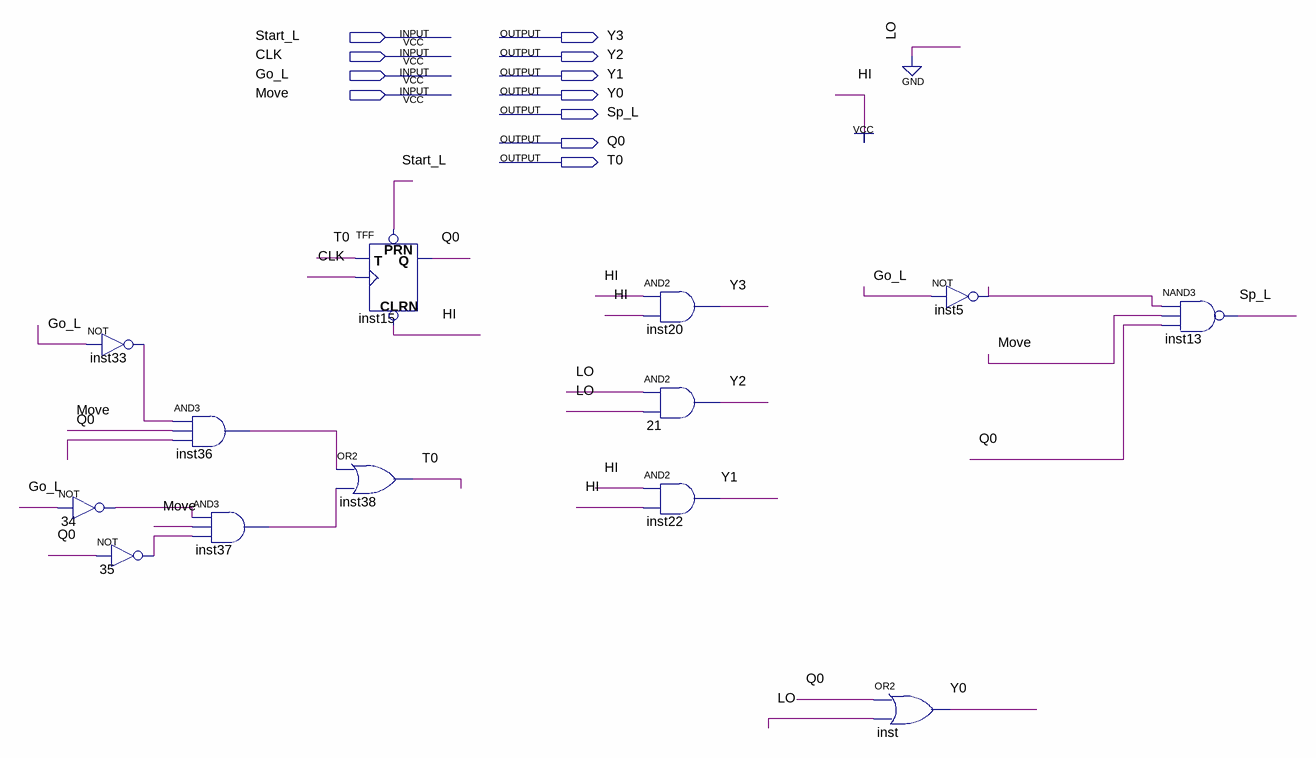
[diagram p0: schematic sheet]
// Quartus schematic Practial2.bdf as structural Verilog: 13 symbols, 11 pins
module Practial2 (
  input  Start_L,
  input  CLK,
  input  Go_L,
  input  Move,
  output Y3,
  output Y2,
  output Y1,
  output Y0,
  output Sp_L,
  output Q0,
  output T0
);

  wire inst5_out, inst33_out, inst36_out, inst37_out, n34_out, n35_out;

  not inst33 (inst33_out, Go_L);
  not u_34 (n34_out, Go_L);
  not u_35 (n35_out, Q0);
  and inst36 (inst36_out, inst33_out, Move, Q0);
  and inst37 (inst37_out, n34_out, Move, n35_out);
  TFF inst15 (.PRN(Start_L), .CLRN(1'b1), .T(T0), .CLK(CLK), .Q(Q0));
  or inst38 (T0, inst36_out, inst37_out);
  and inst20 (Y3, 1'b1, 1'b1);
  and u_21 (Y2, 1'b0, 1'b0);
  and inst22 (Y1, 1'b1, 1'b1);
  or inst (Y0, Q0, 1'b0);
  not inst5 (inst5_out, Go_L);
  nand inst13 (Sp_L, inst5_out, Move, Q0);
endmodule
